# Altium schematic sheet Controller.SchDoc: 地震波采集系统
size A4; Author: Jingxiang Wang; Engineer: Jingxiang Wang; Organization: UESTC; SheetNumber: 2; SheetTotal: 3
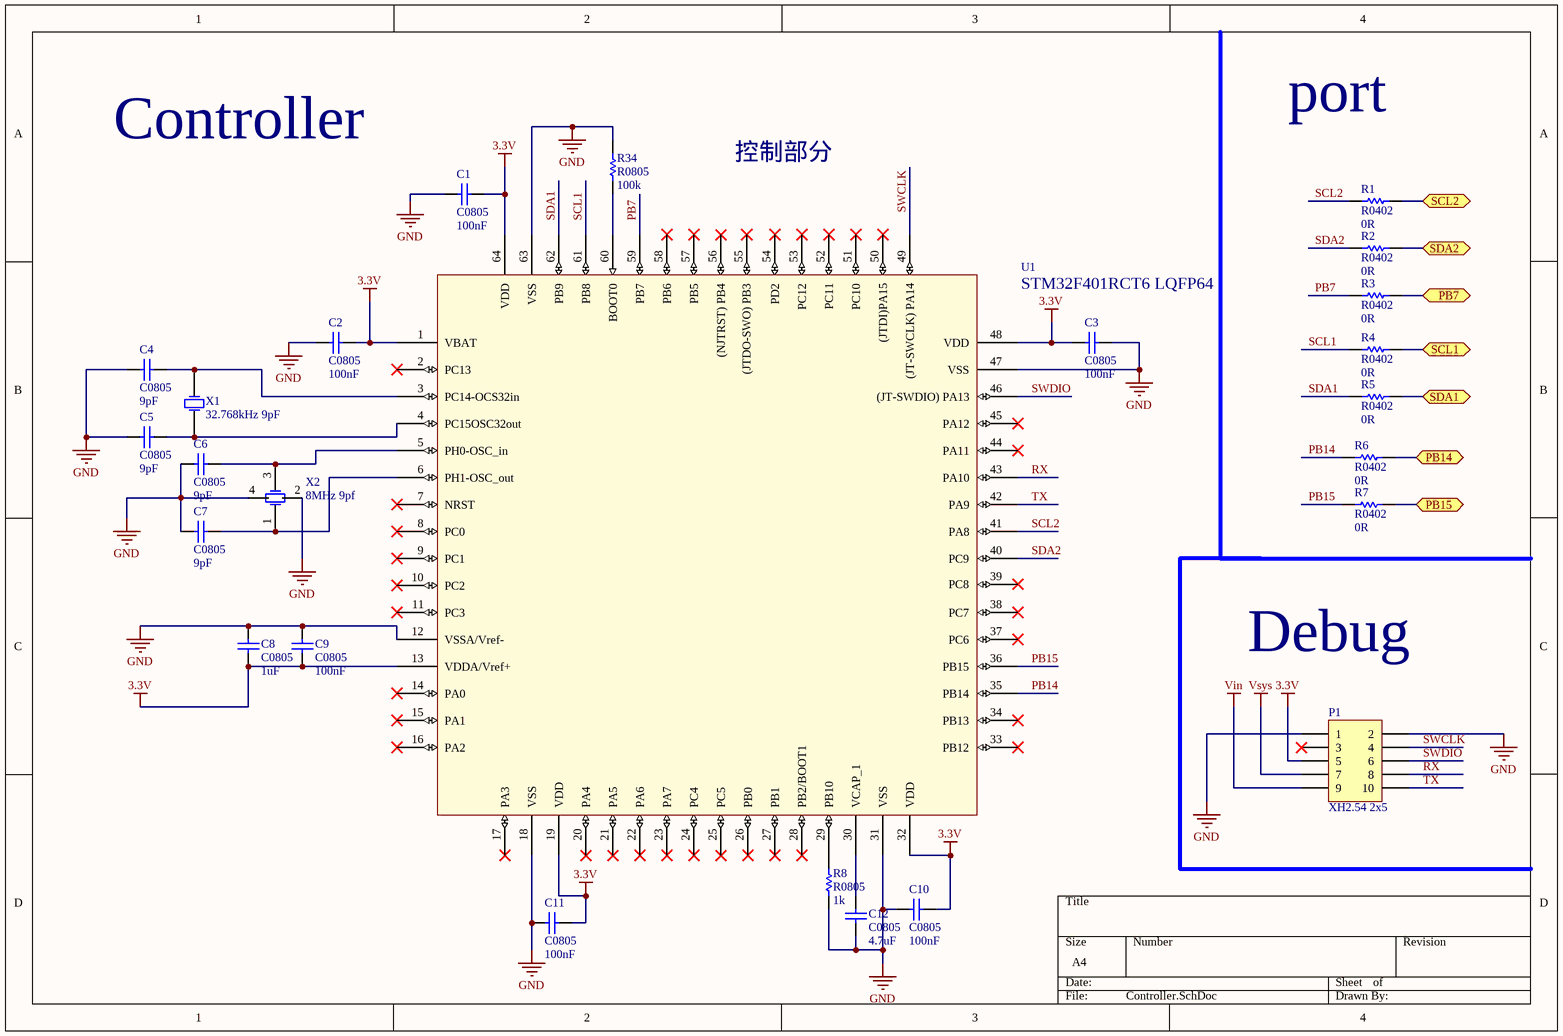
[diagram p0: Controller.SchDoc]

## Parts
C1  Case/Package: C0805  [C0805_200X125X140L50N]  (hidden comment: 100nF)
C2  Case/Package: C0805  [C0805_200X125X140L50N]  (hidden comment: 100nF)
C3  Case/Package: C0805  [C0805_200X125X140L50N]  (hidden comment: 100nF)
C4  Case/Package: C0805  [C0805_200X125X140L50N]  (hidden comment: 9pF)
C5  Case/Package: C0805  [C0805_200X125X140L50N]  (hidden comment: 9pF)
C6  Case/Package: C0805  [C0805_200X125X140L50N]  (hidden comment: 9pF)
C7  Case/Package: C0805  [C0805_200X125X140L50N]  (hidden comment: 9pF)
C8  Case/Package: C0805  [C0805_200X125X140L50N]  (hidden comment: 1uF)
C9  Case/Package: C0805  [C0805_200X125X140L50N]  (hidden comment: 100nF)
C10  Case/Package: C0805  [C0805_200X125X140L50N]  (hidden comment: 100nF)
C11  Case/Package: C0805  [C0805_200X125X140L50N]  (hidden comment: 100nF)
C12  Case/Package: C0805  [C0805_200X125X140L50N]  (hidden comment: 4.7uF)
P1  XH2.54 2x5  [HDR2X5]
R1  Case/Package: R0402  [R0402_100X50X140L30N]  (hidden comment: 0R)
R2  Case/Package: R0402  [R0402_100X50X140L30N]  (hidden comment: 0R)
R3  Case/Package: R0402  [R0402_100X50X140L30N]  (hidden comment: 0R)
R4  Case/Package: R0402  [R0402_100X50X140L30N]  (hidden comment: 0R)
R5  Case/Package: R0402  [R0402_100X50X140L30N]  (hidden comment: 0R)
R6  Case/Package: R0402  [R0402_100X50X140L30N]  (hidden comment: 0R)
R7  Case/Package: R0402  [R0402_100X50X140L30N]  (hidden comment: 0R)
R8  Case/Package: R0805  [R0805_200X125X140L50N]  (hidden comment: 1k)
R34  Case/Package: R0805  [R0805_200X125X140L50N]  (hidden comment: 100k)
U1  STM32F401RCT6_LQFP64  [STM32F401RCT6 LQFP64]  (value not drawn)
X1  Seiko SC-32S32.768kHz20PPM9pF  [Crystal Seiko 32.768kHz]  (value not drawn)
X2  #name: 8MHz 9pf  [Crystal YXC 32MHz - 3225]  (hidden comment: 8MHz 8pf 3225)

## Ports
PB7 (bidir), PB14 (bidir), PB15 (bidir), SCL1 (bidir), SCL2 (bidir), SDA1 (bidir), SDA2 (bidir)

## Nets
3.3V: C1.2 C2.2 C3.1 C8.2 C9.1 C10.2 C11.2 P1.5 U1.1(VBAT) U1.13(VDDA/Vref+) U1.19(VDD) U1.32(VDD) U1.48(VDD) U1.64(VDD)
GND: C1.1 C2.1 C3.2 C4.1 C5.1 C6.1 C7.1 C8.1 C9.2 C10.1 C11.1 C12.1 P1.1 P1.2 R8.1 R34.2 U1.12(VSSA/Vref-) U1.18(VSS) U1.31(VSS) U1.47(VSS) U1.63(VSS) X2.2(GND) X2.4(OSC2)
Vin: P1.9
Vsys: P1.7
PB7: R3.2 ; port PB7
PB7: R3.1 U1.59(PB7)  [a separate net that carries the same name]
PB14: R6.2 ; port PB14
PB14: R6.1 U1.35(PB14)  [a separate net that carries the same name]
PB15: R7.2 ; port PB15
PB15: R7.1 U1.36(PB15)  [a separate net that carries the same name]
RX: P1.8 U1.43(PA10)
SCL1: R4.2 ; port SCL1
SCL1: R4.1 U1.61(PB8)  [a separate net that carries the same name]
SCL2: R1.2 ; port SCL2
SCL2: R1.1 U1.41(PA8)  [a separate net that carries the same name]
SDA1: R5.2 ; port SDA1
SDA1: R5.1 U1.62(PB9)  [a separate net that carries the same name]
SDA2: R2.2 ; port SDA2
SDA2: R2.1 U1.40(PC9)  [a separate net that carries the same name]
SWCLK: P1.4 U1.49((JT-SWCLK)_PA14)
SWDIO: P1.6 U1.46((JT-SWDIO)_PA13)
TX: P1.10 U1.42(PA9)
NetC4_2: C4.2 U1.3(PC14-OCS32in) X1.2(OSC2)
NetC5_2: C5.2 U1.4(PC15OSC32out) X1.1(OSC1)
NetC6_2: C6.2 U1.5(PH0-OSC_in) X2.3(OSC2)
NetC7_2: C7.2 U1.6(PH1-OSC_out) X2.1(OSC1)
NetC12_2: C12.2 U1.30(VCAP_1)
NetR8_2: R8.2 U1.29(PB10)
NetR34_1: R34.1 U1.60(BOOT0)

Not connected (* = marked no-connect by the designer): P1 3*; U1 2(PC13)* 7(NRST)* 8(PC0)* 9(PC1)* 10(PC2)* 11(PC3)* 14(PA0)* 15(PA1)* 16(PA2)* 17(PA3)* 20(PA4)* 21(PA5)* 22(PA6)* 23(PA7)* 24(PC4)* 25(PC5)* 26(PB0)* 27(PB1)* 28(PB2/BOOT1)* 33(PB12)* 34(PB13)* 37(PC6)* 38(PC7)* 39(PC8)* 44(PA11)* 45(PA12)* 50((JTDI)PA15)* 51(PC10)* 52(PC11)* 53(PC12)* 54(PD2)* 55((JTDO-SWO)_PB3)* 56((NJTRST)_PB4)* 57(PB5)* 58(PB6)*

## Notes on the sheet
- Controller
- 控制部分
- port
- Debug
- (in symbol CrystalOscillator-2) 32.768kHz 9pF

## Library data of the parts
C1-C12 = Cap0805: 0805 SMT MLCC Capacitor; Voltage: 50V; Tolerance: 10%; ProductIndex: 11; Published: 8-Jun-2000; LatestRevisionDate: 17-Jul-2002; LatestRevisionNote: Re-released for DXP Platform.; PackageReference: RAD-0.3; Publisher: Altium Limited; PackageDescription: Radial Cap, Thru-Hole; 2 Leads; 0.3 in Pin Spacing; Voltage Rating: 50V; ProductType: Capacitors
  C1-C3 C9-C11: Value: 100nF
  C4-C7: Value: 9pF
  C8: Value: 1uF
  C12: Value: 4.7uF
P1 = Header 5X2A: Header, 5-Pin, Dual row; LatestRevisionDate: 17-Jul-2002; LatestRevisionNote: Re-released for DXP Platform.; Publisher: Altium Limited
R1-R7 = Res0402: 0402 SMT Resistor; Tolerance: 1%; ProductIndex: 10; Published: 8-Jun-2000; LatestRevisionDate: 17-Jul-2002; LatestRevisionNote: Re-released for DXP Platform.; PackageReference: AXIAL-0.3; Publisher: Altium Limited; PackageDescription: Axial Device, Thru-Hole; 2 Leads; 0.3 in Pin Spacing; ProductType: Resistors; Value: 0R
R8 R34 = Res0805: 0805 SMT Resistor; Tolerance: 1%; ProductIndex: 10; Published: 8-Jun-2000; LatestRevisionDate: 17-Jul-2002; LatestRevisionNote: Re-released for DXP Platform.; PackageReference: AXIAL-0.3; Publisher: Altium Limited; PackageDescription: Axial Device, Thru-Hole; 2 Leads; 0.3 in Pin Spacing; ProductType: Resistors
  R8: Value: 1k
  R34: Value: 100k
U1 = STM32F401RCT6_LQFP64: STM32F401RCT6 LQFP64; 1创建: 高鹏201709229; 型号说明: LQFP64 10*10mm; 2修改: *; name: STM32F401RCT6 LQFP64
X1 = CrystalOscillator-2: 晶振-2脚; 创建: 高鹏20160422
X2 = CrystalOscillator-4: 晶振-4脚; 1创建: 高鹏20171028; 2修改: *